# Altium project Loadcell.PrjPcb
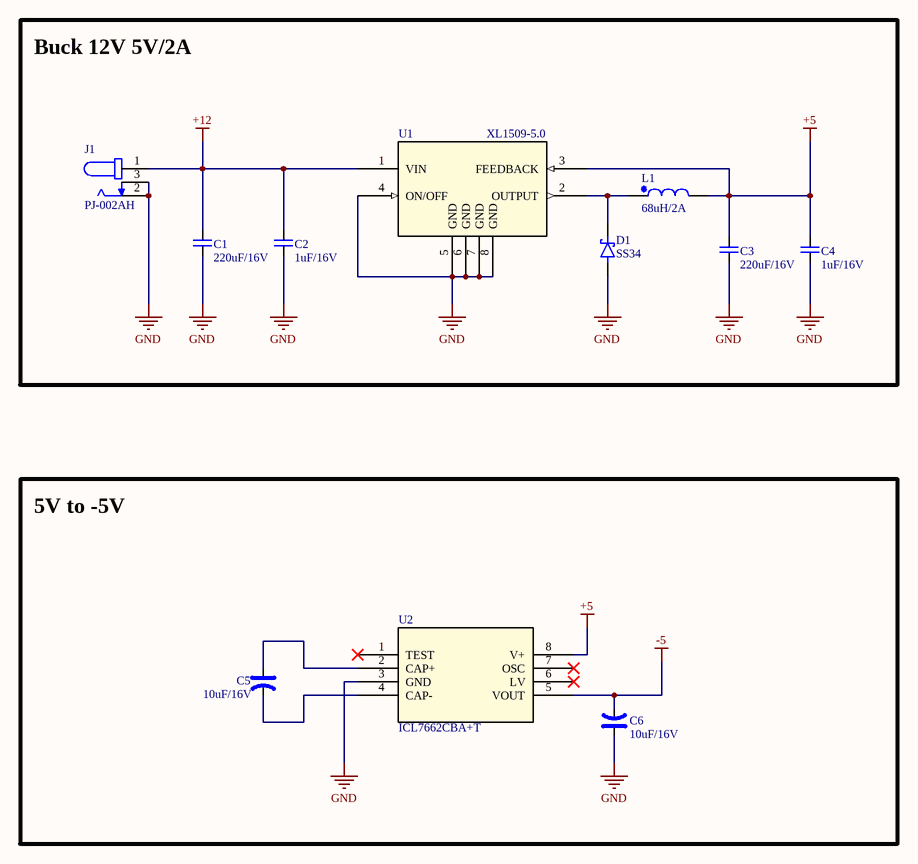
[diagram p0: power.SchDoc]
2 sheets, 48 parts. Net scope: global (net labels, ports and power ports of the same name join across sheets).
Board file: PCB2.PcbDoc
Sheets:
  power.SchDoc
  loadcell.SchDoc

## Sheet power.SchDoc
size A3; SheetNumber: 1; SheetTotal: 1

### Parts
C1  220uF/16V  [CAP_C_1608X80]
C2  1uF/16V  [CAP_C_1608X80]
C3  220uF/16V  [CAP_C_1608X80]
C4  1uF/16V  [CAP_C_1608X80]
C5  10uF/16V  [CAP_MP_1608X90]
C6  10uF/16V  [CAP_MP_1608X90]
D1  SS34  [DIOM7959X265N]
J1  PJ-002AH  [CUI_PJ-002AH]
L1  68uH/2A  [IND730660x480]
U1  XL1509-5.0  [SOP8SOIC-8_UMW]
U2  ICL7662CBA+T  [21-0041B_8_MXM]

### Blocks framed on the sheet
Buck 12V 5V/2A: C1-C4 D1 J1 L1 U1
5V to -5V: C5 C6 U2

### Nets
+5: C3.2 C4.2 L1.2 U1.3(FEEDBACK) U2.8(V+)
+12: C1.2 C2.2 J1.1 U1.1(VIN)  [project net Vout+]
-5: C6.2 U2.5(VOUT)
GND: C1.1 C2.1 C3.1 C4.1 C6.1 D1.A J1.2 J1.3 U1.4(ON/OFF) U1.5(GND) U1.6(GND) U1.7(GND) U1.8(GND) U2.3(GND)
NetC5_1: C5.1 U2.2(CAP+)
NetC5_2: C5.2 U2.4(CAP-)
NetD1_C: D1.C(K) L1.1 U1.2(OUTPUT)

Not connected (* = marked no-connect by the designer): U2 1(TEST)* 6(LV)* 7(OSC)*

### Notes on the sheet
- Project:
- Sub-system:
- Designed by:
- Sheet title:
- Sheet
- of
- Checked by:
- Approved by:
- Doc No:
- Revision:
- Size:
- Date:
- A3

### Library data of the parts
C1-C4 = CAP_SMD: CAP_Chip; Value: 33pF
C5 C6 = CAP_TH: CAP_Polarization; Published: 8-Jun-2000; LatestRevisionDate: 17-Jul-2002; LatestRevisionNote: Re-released for DXP Platform.; PackageReference: POLAR0.8; Publisher: Altium Limited
D1 = SS34: Diode Schottky 40 V 3A Surface Mount SMC (DO-214AB); MF: onsemi; SnapEDA_Link: https://www.snapeda.com/parts/SS34/Onsemi/view-part/?ref=snap; Package: SMC-2 ON Semiconductor; Value: *; MP: SS34; Check_prices: https://www.snapeda.com/parts/SS34/Onsemi/view-part/?ref=eda
J1 = PJ-002AH: 2.0 x 6.5 mm, 5.0 A, Horizontal, Through Hole, Dc Power Jack Connector; MF: Same Sky; SnapEDA_Link: https://www.snapeda.com/parts/PJ-002AH/Same+Sky/view-part/?ref=snap; Package: None; Value: *; MP: PJ-002AH; Check_prices: https://www.snapeda.com/parts/PJ-002AH/Same+Sky/view-part/?ref=eda
L1 = _IND
U1 = XL1509-5.0: Description; Manufacturer_Name: UMW(Youtai Semiconductor Co., Ltd.); Copyright: Copyright (C) 2025 Ultra Librarian. All rights reserved.; Manufacturer_Part_Number: XL1509-5.0; RefDes: RefDes; Type: Type
U2 = ICL7662CBA+T: CMOS Voltage Converters; Manufacturer_Name: Analog Devices / Maxim Integrated; Copyright: Copyright (C) 2025 Ultra Librarian. All rights reserved.; Manufacturer_Part_Number: ICL7662CBA+T; RefDes: RefDes; Type: Type

## Sheet loadcell.SchDoc
size A3; SheetNumber: 2; SheetTotal: 2
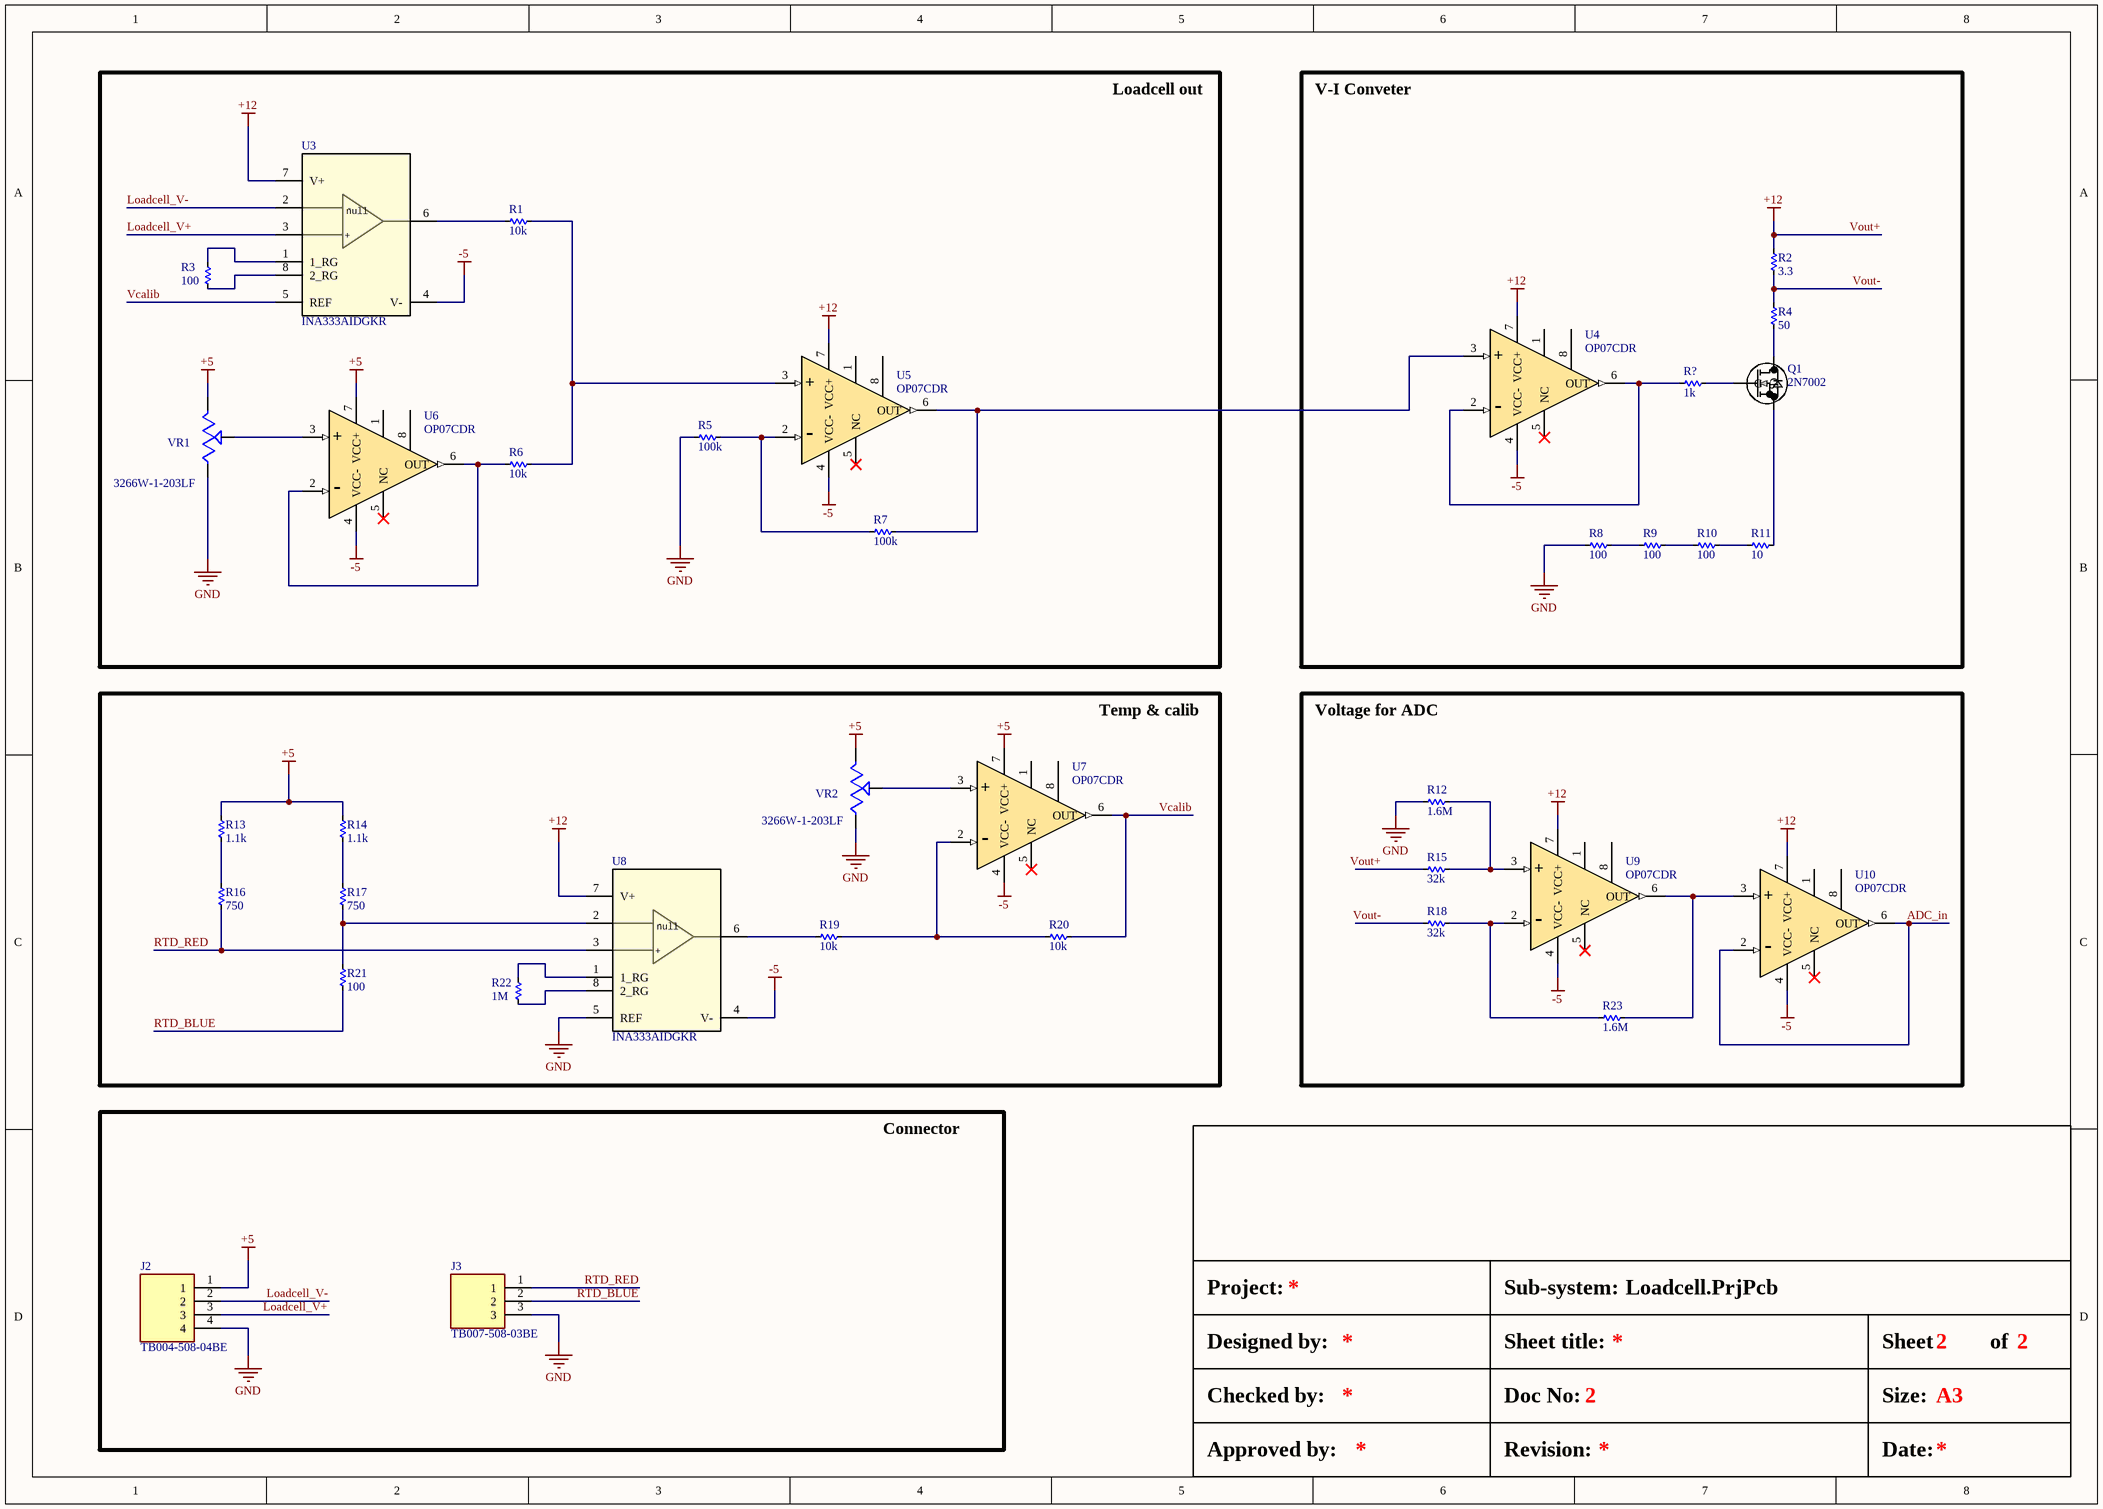
[diagram p1: loadcell.SchDoc]

### Parts
J2  TB004-508-04BE  [CUI_TB004-508-04BE]
J3  TB007-508-03BE  [CUI_TB007-508-03BE]
Q1  2N7002  [SOT-23TO-236_318-08_ONS]
R1  10k  [RES_C_1608X60]
R2  3.3  [RES_C_1608X60]
R3  100  [RES_C_1608X60]
R4  50  [RES_C_1608X60]
R5  100k  [RES_C_1608X60]
R6  10k  [RES_C_1608X60]
R7  100k  [RES_C_1608X60]
R8  100  [RES_C_1608X60]
R9  100  [RES_C_1608X60]
R10  100  [RES_C_1608X60]
R11  10  [RES_C_1608X60]
R12  1.6M  [RES_C_1608X60]
R13  1.1k  [RES_C_1608X60]
R14  1.1k  [RES_C_1608X60]
R15  32k  [RES_C_1608X60]
R16  750  [RES_C_1608X60]
R17  750  [RES_C_1608X60]
R18  32k  [RES_C_1608X60]
R19  10k  [RES_C_1608X60]
R20  10k  [RES_C_1608X60]
R21  100  [RES_C_1608X60]
R22  1M  [RES_C_1608X60]
R23  1.6M  [RES_C_1608X60]
R?  1k  [RES_C_1608X60]
U3  INA333AIDGKR  [DGK0008A-MFG]
U4  OP07CDR  [D8]
U5  OP07CDR  [D8]
U6  OP07CDR  [D8]
U7  OP07CDR  [D8]
U8  INA333AIDGKR  [DGK0008A-MFG]
U9  OP07CDR  [D8]
U10  OP07CDR  [D8]
VR1  3266W-1-203LF  [TRIM_3266W-1-203LF]
VR2  3266W-1-203LF  [TRIM_3266W-1-203LF]

### Blocks framed on the sheet
Loadcell out: R1 R3 R5-R7 U3 U5 U6 VR1
V-I Conveter: Q1 R2 R4 R8-R11 R? U4
Temp & calib: R13 R14 R16 R17 R19-R22 U7 U8 VR2
Voltage for ADC: R12 R15 R18 R23 U9 U10
Connector: J2 J3

### Nets
+5: J2.1 R13.1 R14.1 U6.7(VCC+) U7.7(VCC+) VR1.3(CW) VR2.3(CW)
-5: U3.4(V-) U4.4(VCC-) U5.4(VCC-) U6.4(VCC-) U7.4(VCC-) U8.4(V-) U9.4(VCC-) U10.4(VCC-)
GND: J2.4 J3.3 R5.1 R8.1 R12.1 U8.5(REF) VR1.1(CCW) VR2.1(CCW)
Vout+: R2.2 R15.1 U3.7(V+) U4.7(VCC+) U5.7(VCC+) U8.7(V+) U9.7(VCC+) U10.7(VCC+)  [also labelled +12]
ADC_in: U10.2(IN-) U10.6(OUT)
Loadcell_V+: J2.3 U3.3(VIN+)
Loadcell_V-: J2.2 U3.2(VIN-)
RTD_BLUE: J3.2 R21.2
RTD_RED: J3.1 R16.2 U8.3(VIN+)
Vcalib: R20.1 U3.5(REF) U7.6(OUT)
Vout-: R2.1 R4.2 R18.1
NetQ1_1: Q1.1(G) R?.2
NetQ1_2: Q1.2(S) R11.2
NetQ1_3: Q1.3(D) R4.1
NetR1_1: R1.1 R6.1 U5.3(IN+)
NetR1_2: R1.2 U3.6(VOUT)
NetR3_1: R3.1 U3.8(2_RG)
NetR3_2: R3.2 U3.1(1_RG)
NetR5_2: R5.2 R7.1 U5.2(IN-)
NetR6_2: R6.2 U6.2(IN-) U6.6(OUT)
NetR7_2: R7.2 U4.3(IN+) U5.6(OUT)
NetR8_2: R8.2 R9.1
NetR9_2: R9.2 R10.1
NetR10_2: R10.2 R11.1
NetR12_2: R12.2 R15.2 U9.3(IN+)
NetR13_2: R13.2 R16.1
NetR14_2: R14.2 R17.1
NetR17_2: R17.2 R21.1 U8.2(VIN-)
NetR18_2: R18.2 R23.1 U9.2(IN-)
NetR19_1: R19.1 R20.2 U7.2(IN-)
NetR19_2: R19.2 U8.6(VOUT)
NetR22_1: R22.1 U8.8(2_RG)
NetR22_2: R22.2 U8.1(1_RG)
NetR23_2: R23.2 U9.6(OUT) U10.3(IN+)
NetR?_1: R?.1 U4.2(IN-) U4.6(OUT)
NetU6_3: U6.3(IN+) VR1.2(WIPER)
NetU7_3: U7.3(IN+) VR2.2(WIPER)

Not connected (* = marked no-connect by the designer): U4 1(OFFSETN1) 5(NC)* 8(OFFSETN2); U5 1(OFFSETN1) 5(NC)* 8(OFFSETN2); U6 1(OFFSETN1) 5(NC)* 8(OFFSETN2); U7 1(OFFSETN1) 5(NC)* 8(OFFSETN2); U9 1(OFFSETN1) 5(NC)* 8(OFFSETN2); U10 1(OFFSETN1) 5(NC)* 8(OFFSETN2)

### Notes on the sheet
- Project:
- Sub-system:
- Designed by:
- Sheet title:
- Sheet
- of
- Checked by:
- Approved by:
- Doc No:
- Revision:
- Size:
- Date:
- A3
- (in symbol INA333AIDGKR) null; -; +
- (in symbol OP07CDR) +; -

### Library data of the parts
J2 = TB004-508-04BE: 2~24 Poles, Screw Type, Horizontal, 5.08 Pitch, 24~12 (AWG), Terminal Block Connector; MF: Same Sky; SnapEDA_Link: https://www.snapeda.com/parts/TB004-508-04BE/Same+Sky/view-part/?ref=snap; Package: None; Value: *; MP: TB004-508-04BE; Check_prices: https://www.snapeda.com/parts/TB004-508-04BE/Same+Sky/view-part/?ref=eda
J3 = TB007-508-03BE: 2~24 Poles, Screw Type, Horizontal, 5.08 Pitch, 24~12 (AWG), Terminal Block Connector; MF: Same Sky; SnapEDA_Link: https://www.snapeda.com/parts/TB007-508-03BE/Same+Sky/view-part/?ref=snap; Package: None; Value: *; MP: TB007-508-03BE; Check_prices: https://www.snapeda.com/parts/TB007-508-03BE/Same+Sky/view-part/?ref=eda
Q1 = 2N7002: Description; Manufacturer_Name: onsemi; Copyright: Copyright (C) 2025 Ultra Librarian. All rights reserved.; Manufacturer_Part_Number: 2N7002
R1-R23 R? = _RES_B_2: RES
U3 U8 = INA333AIDGKR: Low-Power, Zero-Drift, Precision Instrumentation Amplifier 8-VSSOP -40 to 125; Manufacturer_Name: Texas Instruments; TYPE: TYPE; RefDes: RefDes; Copyright: Copyright (C) 2025 Ultra Librarian. All rights reserved.; Manufacturer_Part_Number: INA333AIDGKR
U4-U7 U9 U10 = OP07CDR: Low-offset voltage, single operational amplifier with external input offset voltage adjustment 8-SOIC 0 to 70; Manufacturer_Name: Texas Instruments; Copyright: Copyright (C) 2025 Ultra Librarian. All rights reserved.; Manufacturer_Part_Number: OP07CDR; RefDes: RefDes; Type: Type
VR1 VR2 = 3266W-1-203LF: 20 kOhms 0.25W, 1/4W PC Pins Through Hole Trimmer Potentiometer Cermet 12 Turn Top Adjustment; MF: Bourns; Price: None; Check_prices: https://www.snapeda.com/parts/3266W-1-203LF/Bourns/view-part/427237/?ref=eda; MP: 3266W-1-203LF; Value: *; Package: TO-218 Bourns; SnapEDA_Link: https://www.snapeda.com/parts/3266W-1-203LF/Bourns/view-part/427237/?ref=snap; Availability: Warning; Purchase-URL: https://pricing.snapeda.com/search/part/3266W-1-203LF/?ref=eda

## Nets that join several sheets
+5: power (5 pins), loadcell (7 pins)
-5: power (C6.2 U2.5), loadcell (8 pins)
GND: power (14 pins), loadcell (8 pins)
Vout+: power (C1.2 C2.2 J1.1 U1.1), loadcell (8 pins)